# Altium schematic sheet MB_pl_io.SchDoc: Материнская плата
size 420 x 297 mm; DrawnBy: В.Титов; DocumentNumber: ХХХХ.468179.001 Э3; SheetNumber: 4; SheetTotal: 7; DocumentType: Схема электрическая принципиальная; Title2: Питание процессора
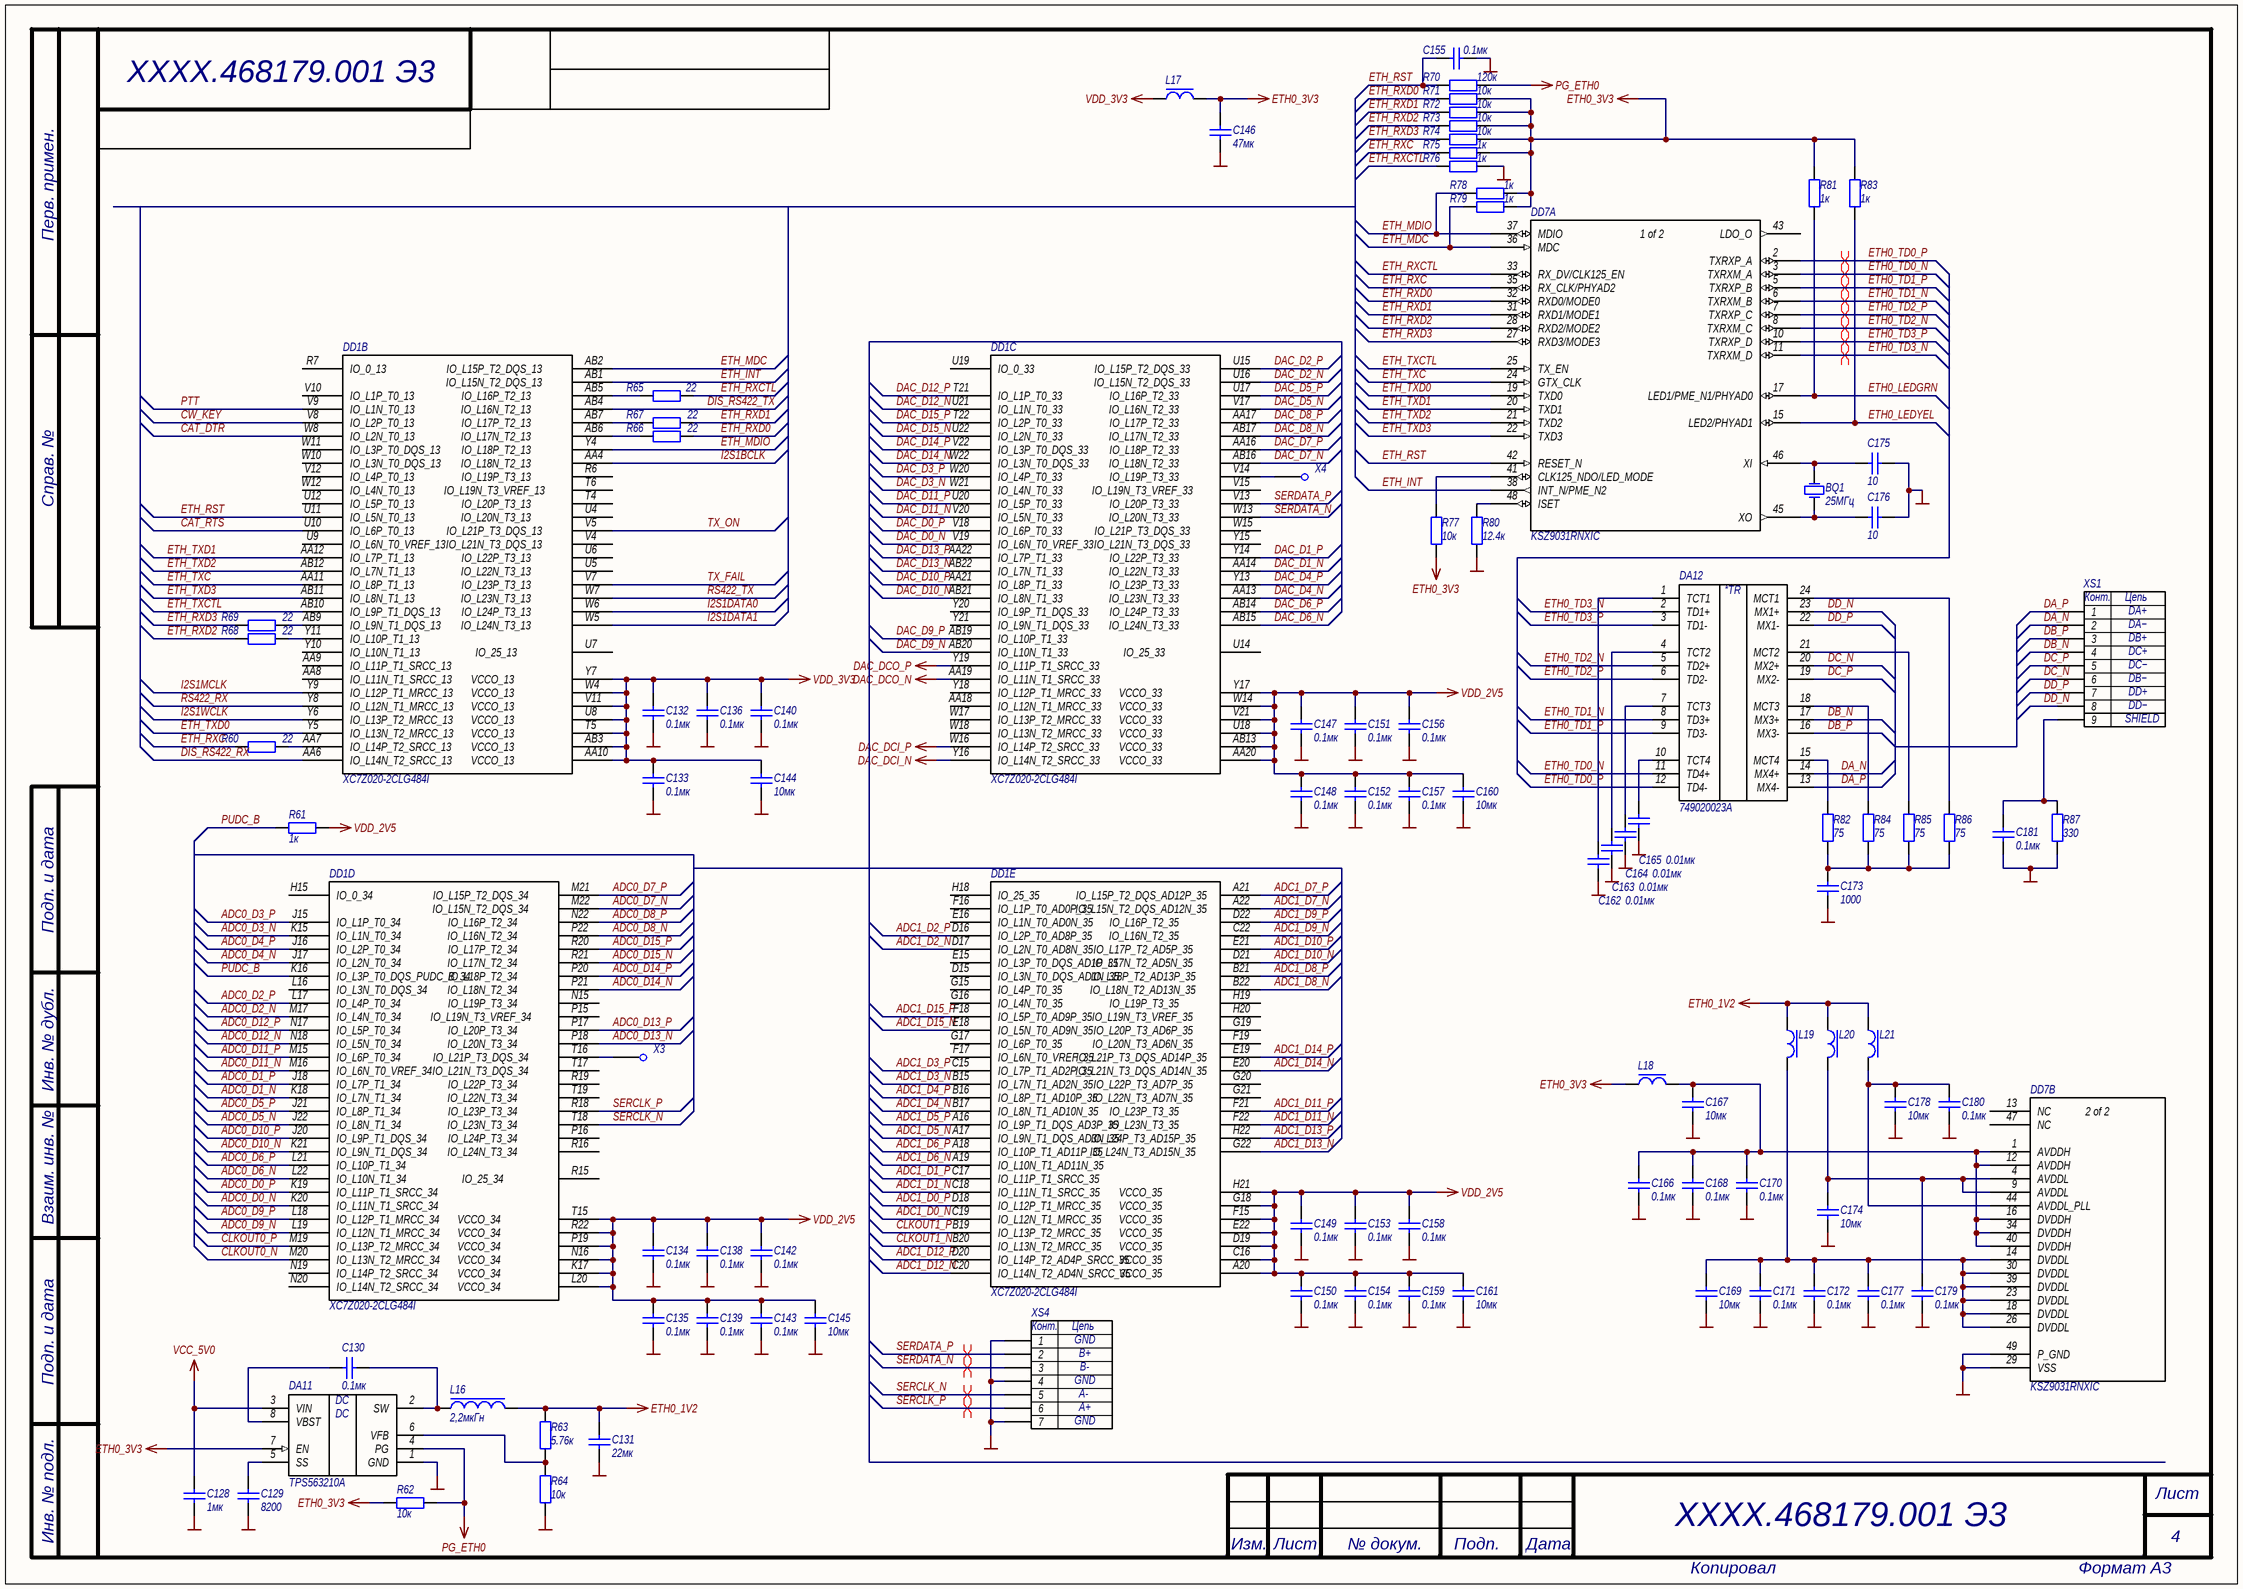
[diagram p0: MB_pl_io.SchDoc]

## Parts
BQ1  25МГц  [ABRACOM ABM10]
C128  1мк  [CAPC1005X06N]
C129  8200  [CAPC1005X06N]
C130  0.1мк  [CAPC1005X06N]
C131  22мк  [CAPC2012X12L]
C132  0.1мк  [CAPC1005X06N]
C133  0.1мк  [CAPC1005X06N]
C134  0.1мк  [CAPC1005X06N]
C135  0.1мк  [CAPC1005X06N]
C136  0.1мк  [CAPC1005X06N]
C138  0.1мк  [CAPC1005X06N]
C139  0.1мк  [CAPC1005X06N]
C140  0.1мк  [CAPC1005X06N]
C142  0.1мк  [CAPC1005X06N]
C143  0.1мк  [CAPC1005X06N]
C144  10мк  [CAPC1608X08L]
C145  10мк  [CAPC1608X08L]
C146  47мк  [CAPC2012X12L]
C147  0.1мк  [CAPC1005X06N]
C148  0.1мк  [CAPC1005X06N]
C149  0.1мк  [CAPC1005X06N]
C150  0.1мк  [CAPC1005X06N]
C151  0.1мк  [CAPC1005X06N]
C152  0.1мк  [CAPC1005X06N]
C153  0.1мк  [CAPC1005X06N]
C154  0.1мк  [CAPC1005X06N]
C155  0.1мк  [CAPC1005X06N]
C156  0.1мк  [CAPC1005X06N]
C157  0.1мк  [CAPC1005X06N]
C158  0.1мк  [CAPC1005X06N]
C159  0.1мк  [CAPC1005X06N]
C160  10мк  [CAPC1608X08L]
C161  10мк  [CAPC1608X08L]
C162  0.01мк  [CAPC1005X06N]
C163  0.01мк  [CAPC1005X06N]
C164  0.01мк  [CAPC1005X06N]
C165  0.01мк  [CAPC1005X06N]
C166  0.1мк  [CAPC1005X06N]
C167  10мк  [CAPC1608X08L]
C168  0.1мк  [CAPC1005X06N]
C169  10мк  [CAPC1608X08L]
C170  0.1мк  [CAPC1005X06N]
C171  0.1мк  [CAPC1005X06N]
C172  0.1мк  [CAPC1005X06N]
C173  1000  [CAPC1005X06N]
C174  10мк  [CAPC1608X08L]
C175  10  [CAPC1005X06N]
C176  10  [CAPC1005X06N]
C177  0.1мк  [CAPC1005X06N]
C178  10мк  [CAPC1608X08L]
C179  0.1мк  [CAPC1005X06N]
C180  0.1мк  [CAPC1005X06N]
C181  0.1мк  [CAPC1608X08L]
DA11  TPS563210A  [TSOP65P280X110-8N]
DA12  749020023A  [749020023A]
DD1  XC7Z020-2CLG484I  [BGA484C80P22X22_1900X1900X160]  (parts B,C,D,E of 9)
DD7  KSZ9031RNXIC  [QFN50P700X700-48V6M]  (parts A,B of 2)
L16  2,2мкГн  [CSAB0420]
L17  BLM18PG121SN1D  [INDC1608X08L]  (value not drawn)
L18  BLM18PG121SN1D  [INDC1608X08L]  (value not drawn)
L19  BLM18PG121SN1D  [INDC1608X08L]  (value not drawn)
L20  BLM18PG121SN1D  [INDC1608X08L]  (value not drawn)
L21  BLM18PG121SN1D  [INDC1608X08L]  (value not drawn)
R60  22  [RESC1005X06N]
R61  1к  [RESC1005X06N]
R62  10к  [RESC1005X06N]
R63  5.76к  [RESC1005X06N]
R64  10к  [RESC1005X06N]
R65  22  [RESC1005X06N]
R66  22  [RESC1005X06N]
R67  22  [RESC1005X06N]
R68  22  [RESC1005X06N]
R69  22  [RESC1005X06N]
R70  120к  [RESC1005X06N]
R71  10к  [RESC1005X06N]
R72  10к  [RESC1005X06N]
R73  10к  [RESC1005X06N]
R74  10к  [RESC1005X06N]
R75  1к  [RESC1005X06N]
R76  1к  [RESC1005X06N]
R77  10к  [RESC1005X06N]
R78  1к  [RESC1005X06N]
R79  1к  [RESC1005X06N]
R80  12.4к  [RESC1005X06N]
R81  1к  [RESC1005X06N]
R82  75  [RESC1005X06N]
R83  1к  [RESC1005X06N]
R84  75  [RESC1005X06N]
R85  75  [RESC1005X06N]
R86  75  [RESC1005X06N]
R87  330  [RESC1005X06N]
X3  Конструктивный элемент  [PIN2_PROBE]  (value not drawn)  (no BOM)
X4  Конструктивный элемент  [PIN2_PROBE]  (value not drawn)  (no BOM)
XS1  TJ16S-8P8C  [KLS12-107L]  (value not drawn)
XS4  KLS1-SATA001  [KLS1-SATA001]  (value not drawn)

## Nets
DAC_DCI_N: DD1.Y16(IO_L14N_T2_SRCC_33)
DAC_DCI_P: DD1.W16(IO_L14P_T2_SRCC_33)
DAC_DCO_N: DD1.AA19(IO_L11N_T1_SRCC_33)
DAC_DCO_P: DD1.Y19(IO_L11P_T1_SRCC_33)
ETH0_1V2: C131.2 L16.2 L19.1 L20.1 L21.1 R63.2
ETH0_3V3: C146.2 DA11.7(EN) L17.2 L18.1 R62.2 R71.2 R72.2 R73.2 R74.2 R75.2 R77.2 R78.2 R79.2 R81.1 R83.1
GND: C128.1 C129.1 C131.1 C132.1 C133.1 C134.1 C135.1 C136.1 C138.1 C139.1 C140.1 C142.1 C143.1 C144.1 C145.1 C146.1 C147.1 C148.1 C149.1 C150.1 C151.1 C152.1 C153.1 C154.1 C155.1 C156.1 C157.1 C158.1 C159.1 C160.1 C161.1 C162.1 C163.1 C164.1 C165.1 C166.1 C167.1 C168.1 C169.1 C170.1 C171.1 C172.1 C173.2 C174.1 C175.1 C176.1 C177.1 C178.1 C179.1 C180.1 C181.2 DA11.1(GND) DD7.29(VSS) DD7.49(P_GND) R64.2 R76.2 R80.2 R87.2 XS4.1 XS4.4 XS4.7
PG_ETH0: DA11.4(PG) R62.1 R70.2
VCC_5V0: C128.2 DA11.3(VIN)
VDD_2V5: C134.2 C135.2 C138.2 C139.2 C142.2 C143.2 C145.2 C147.2 C148.2 C149.2 C150.2 C151.2 C152.2 C153.2 C154.2 C156.2 C157.2 C158.2 C159.2 C160.2 C161.2 DD1.A20(VCCO_35) DD1.AA20(VCCO_33) DD1.AB13(VCCO_33) DD1.C16(VCCO_35) DD1.D19(VCCO_35) DD1.E22(VCCO_35) DD1.F15(VCCO_35) DD1.G18(VCCO_35) DD1.H21(VCCO_35) DD1.K17(VCCO_34) DD1.L20(VCCO_34) DD1.N16(VCCO_34) DD1.P19(VCCO_34) DD1.R22(VCCO_34) DD1.T15(VCCO_34) DD1.U18(VCCO_33) DD1.V21(VCCO_33) DD1.W14(VCCO_33) DD1.Y17(VCCO_33) R61.2
VDD_3V3: C132.2 C133.2 C136.2 C140.2 C144.2 DD1.AA10(VCCO_13) DD1.AB3(VCCO_13) DD1.T5(VCCO_13) DD1.U8(VCCO_13) DD1.V11(VCCO_13) DD1.W4(VCCO_13) DD1.Y7(VCCO_13) L17.1
ADC0_D0_N: DD1.K20(IO_L11N_T1_SRCC_34)
ADC0_D0_P: DD1.K19(IO_L11P_T1_SRCC_34)
ADC0_D1_N: DD1.K18(IO_L7N_T1_34)
ADC0_D1_P: DD1.J18(IO_L7P_T1_34)
ADC0_D2_N: DD1.M17(IO_L4N_T0_34)
ADC0_D2_P: DD1.L17(IO_L4P_T0_34)
ADC0_D3_N: DD1.K15(IO_L1N_T0_34)
ADC0_D3_P: DD1.J15(IO_L1P_T0_34)
ADC0_D4_N: DD1.J17(IO_L2N_T0_34)
ADC0_D4_P: DD1.J16(IO_L2P_T0_34)
ADC0_D5_N: DD1.J22(IO_L8N_T1_34)
ADC0_D5_P: DD1.J21(IO_L8P_T1_34)
ADC0_D6_N: DD1.L22(IO_L10N_T1_34)
ADC0_D6_P: DD1.L21(IO_L10P_T1_34)
ADC0_D7_N: DD1.M22(IO_L15N_T2_DQS_34)
ADC0_D7_P: DD1.M21(IO_L15P_T2_DQS_34)
ADC0_D8_N: DD1.P22(IO_L16N_T2_34)
ADC0_D8_P: DD1.N22(IO_L16P_T2_34)
ADC0_D9_N: DD1.L19(IO_L12N_T1_MRCC_34)
ADC0_D9_P: DD1.L18(IO_L12P_T1_MRCC_34)
ADC0_D10_N: DD1.K21(IO_L9N_T1_DQS_34)
ADC0_D10_P: DD1.J20(IO_L9P_T1_DQS_34)
ADC0_D11_N: DD1.M16(IO_L6N_T0_VREF_34)
ADC0_D11_P: DD1.M15(IO_L6P_T0_34)
ADC0_D12_N: DD1.N18(IO_L5N_T0_34)
ADC0_D12_P: DD1.N17(IO_L5P_T0_34)
ADC0_D13_N: DD1.P18(IO_L20N_T3_34)
ADC0_D13_P: DD1.P17(IO_L20P_T3_34)
ADC0_D14_N: DD1.P21(IO_L18N_T2_34)
ADC0_D14_P: DD1.P20(IO_L18P_T2_34)
ADC0_D15_N: DD1.R21(IO_L17N_T2_34)
ADC0_D15_P: DD1.R20(IO_L17P_T2_34)
ADC1_D0_N: DD1.C19(IO_L12N_T1_MRCC_35)
ADC1_D0_P: DD1.D18(IO_L12P_T1_MRCC_35)
ADC1_D1_N: DD1.C18(IO_L11N_T1_SRCC_35)
ADC1_D1_P: DD1.C17(IO_L11P_T1_SRCC_35)
ADC1_D2_N: DD1.D17(IO_L2N_T0_AD8N_35)
ADC1_D2_P: DD1.D16(IO_L2P_T0_AD8P_35)
ADC1_D3_N: DD1.B15(IO_L7N_T1_AD2N_35)
ADC1_D3_P: DD1.C15(IO_L7P_T1_AD2P_35)
ADC1_D4_N: DD1.B17(IO_L8N_T1_AD10N_35)
ADC1_D4_P: DD1.B16(IO_L8P_T1_AD10P_35)
ADC1_D5_N: DD1.A17(IO_L9N_T1_DQS_AD3N_35)
ADC1_D5_P: DD1.A16(IO_L9P_T1_DQS_AD3P_35)
ADC1_D6_N: DD1.A19(IO_L10N_T1_AD11N_35)
ADC1_D6_P: DD1.A18(IO_L10P_T1_AD11P_35)
ADC1_D7_N: DD1.A22(IO_L15N_T2_DQS_AD12N_35)
ADC1_D7_P: DD1.A21(IO_L15P_T2_DQS_AD12P_35)
ADC1_D8_N: DD1.B22(IO_L18N_T2_AD13N_35)
ADC1_D8_P: DD1.B21(IO_L18P_T2_AD13P_35)
ADC1_D9_N: DD1.C22(IO_L16N_T2_35)
ADC1_D9_P: DD1.D22(IO_L16P_T2_35)
ADC1_D10_N: DD1.D21(IO_L17N_T2_AD5N_35)
ADC1_D10_P: DD1.E21(IO_L17P_T2_AD5P_35)
ADC1_D11_N: DD1.F22(IO_L23N_T3_35)
ADC1_D11_P: DD1.F21(IO_L23P_T3_35)
ADC1_D12_N: DD1.C20(IO_L14N_T2_AD4N_SRCC_35)
ADC1_D12_P: DD1.D20(IO_L14P_T2_AD4P_SRCC_35)
ADC1_D13_N: DD1.G22(IO_L24N_T3_AD15N_35)
ADC1_D13_P: DD1.H22(IO_L24P_T3_AD15P_35)
ADC1_D14_N: DD1.E20(IO_L21N_T3_DQS_AD14N_35)
ADC1_D14_P: DD1.E19(IO_L21P_T3_DQS_AD14P_35)
ADC1_D15_N: DD1.E18(IO_L5N_T0_AD9N_35)
ADC1_D15_P: DD1.F18(IO_L5P_T0_AD9P_35)
CAT_DTR: DD1.W8(IO_L2N_T0_13)
CAT_RTS: DD1.U10(IO_L6P_T0_13)
CLKOUT0_N: DD1.M20(IO_L13N_T2_MRCC_34)
CLKOUT0_P: DD1.M19(IO_L13P_T2_MRCC_34)
CLKOUT1_N: DD1.B20(IO_L13N_T2_MRCC_35)
CLKOUT1_P: DD1.B19(IO_L13P_T2_MRCC_35)
CW_KEY: DD1.V8(IO_L2P_T0_13)
DA_N: DA12.14(MX4+) XS1.2
DA_P: DA12.13(MX4-) XS1.1
DAC_D0_N: DD1.V19(IO_L6N_T0_VREF_33)
DAC_D0_P: DD1.V18(IO_L6P_T0_33)
DAC_D1_N: DD1.AA14(IO_L22N_T3_33)
DAC_D1_P: DD1.Y14(IO_L22P_T3_33)
DAC_D2_N: DD1.U16(IO_L15N_T2_DQS_33)
DAC_D2_P: DD1.U15(IO_L15P_T2_DQS_33)
DAC_D3_N: DD1.W21(IO_L4N_T0_33)
DAC_D3_P: DD1.W20(IO_L4P_T0_33)
DAC_D4_N: DD1.AA13(IO_L23N_T3_33)
DAC_D4_P: DD1.Y13(IO_L23P_T3_33)
DAC_D5_N: DD1.V17(IO_L16N_T2_33)
DAC_D5_P: DD1.U17(IO_L16P_T2_33)
DAC_D6_N: DD1.AB15(IO_L24N_T3_33)
DAC_D6_P: DD1.AB14(IO_L24P_T3_33)
DAC_D7_N: DD1.AB16(IO_L18N_T2_33)
DAC_D7_P: DD1.AA16(IO_L18P_T2_33)
DAC_D8_N: DD1.AB17(IO_L17N_T2_33)
DAC_D8_P: DD1.AA17(IO_L17P_T2_33)
DAC_D9_N: DD1.AB20(IO_L10N_T1_33)
DAC_D9_P: DD1.AB19(IO_L10P_T1_33)
DAC_D10_N: DD1.AB21(IO_L8N_T1_33)
DAC_D10_P: DD1.AA21(IO_L8P_T1_33)
DAC_D11_N: DD1.V20(IO_L5N_T0_33)
DAC_D11_P: DD1.U20(IO_L5P_T0_33)
DAC_D12_N: DD1.U21(IO_L1N_T0_33)
DAC_D12_P: DD1.T21(IO_L1P_T0_33)
DAC_D13_N: DD1.AB22(IO_L7N_T1_33)
DAC_D13_P: DD1.AA22(IO_L7P_T1_33)
DAC_D14_N: DD1.W22(IO_L3N_T0_DQS_33)
DAC_D14_P: DD1.V22(IO_L3P_T0_DQS_33)
DAC_D15_N: DD1.U22(IO_L2N_T0_33)
DAC_D15_P: DD1.T22(IO_L2P_T0_33)
DB_N: DA12.17(MX3+) XS1.4
DB_P: DA12.16(MX3-) XS1.3
DC_N: DA12.20(MX2+) XS1.6
DC_P: DA12.19(MX2-) XS1.5
DD_N: DA12.23(MX1+) XS1.8
DD_P: DA12.22(MX1-) XS1.7
DIS_RS422_RX: DD1.AA6(IO_L14N_T2_SRCC_13)
DIS_RS422_TX: DD1.AB4(IO_L16N_T2_13)
ETH0_LEDGRN: DD7.17(LED1/PME_N1/PHYAD0) R81.2
ETH0_LEDYEL: DD7.15(LED2/PHYAD1) R83.2
ETH0_TD0_N: DA12.11(TD4+) DD7.3(TXRXM_A)
ETH0_TD0_P: DA12.12(TD4-) DD7.2(TXRXP_A)
ETH0_TD1_N: DA12.8(TD3+) DD7.6(TXRXM_B)
ETH0_TD1_P: DA12.9(TD3-) DD7.5(TXRXP_B)
ETH0_TD2_N: DA12.5(TD2+) DD7.8(TXRXM_C)
ETH0_TD2_P: DA12.6(TD2-) DD7.7(TXRXP_C)
ETH0_TD3_N: DA12.2(TD1+) DD7.11(TXRXM_D)
ETH0_TD3_P: DA12.3(TD1-) DD7.10(TXRXP_D)
ETH_INT: DD1.AB1(IO_L15N_T2_DQS_13) DD7.38(INT_N/PME_N2)
ETH_MDC: DD1.AB2(IO_L15P_T2_DQS_13) DD7.36(MDC) R79.1
ETH_MDIO: DD1.Y4(IO_L18P_T2_13) DD7.37(MDIO) R78.1
ETH_RST: C155.2 DD1.U11(IO_L5N_T0_13) DD7.42(RESET_N) R70.1
ETH_RXC: DD7.35(RX_CLK/PHYAD2) R60.1 R75.1
ETH_RXCTL: DD7.33(RX_DV/CLK125_EN) R65.1 R76.1
ETH_RXD0: DD7.32(RXD0/MODE0) R66.2 R71.1
ETH_RXD1: DD7.31(RXD1/MODE1) R67.2 R72.1
ETH_RXD2: DD7.28(RXD2/MODE2) R68.1 R73.1
ETH_RXD3: DD7.27(RXD3/MODE3) R69.1 R74.1
ETH_TXC: DD1.AA11(IO_L8P_T1_13) DD7.24(GTX_CLK)
ETH_TXCTL: DD1.AB10(IO_L9P_T1_DQS_13) DD7.25(TX_EN)
ETH_TXD0: DD1.Y5(IO_L13N_T2_MRCC_13) DD7.19(TXD0)
ETH_TXD1: DD1.AA12(IO_L7P_T1_13) DD7.20(TXD1)
ETH_TXD2: DD1.AB12(IO_L7N_T1_13) DD7.21(TXD2)
ETH_TXD3: DD1.AB11(IO_L8N_T1_13) DD7.22(TXD3)
I2S1BCLK: DD1.AA4(IO_L18N_T2_13)
I2S1DATA0: DD1.W6(IO_L24P_T3_13)
I2S1DATA1: DD1.W5(IO_L24N_T3_13)
I2S1MCLK: DD1.Y9(IO_L12P_T1_MRCC_13)
I2S1WCLK: DD1.Y6(IO_L13P_T2_MRCC_13)
PTT: DD1.V9(IO_L1N_T0_13)
PUDC_B: DD1.K16(IO_L3P_T0_DQS_PUDC_B_34) R61.1
RS422_RX: DD1.Y8(IO_L12N_T1_MRCC_13)
RS422_TX: DD1.W7(IO_L23N_T3_13)
SERCLK_N: DD1.T18(IO_L23N_T3_34) XS4.5
SERCLK_P: DD1.R18(IO_L23P_T3_34) XS4.6
SERDATA_N: DD1.W13(IO_L20N_T3_33) XS4.3
SERDATA_P: DD1.V13(IO_L20P_T3_33) XS4.2
TX_FAIL: DD1.V7(IO_L23P_T3_13)
TX_ON: DD1.V5(IO_L21P_T3_DQS_13)
NetBQ1_1: BQ1.1(OSC1) C175.2 DD7.46(XI)
NetBQ1_3: BQ1.3(OSC2) C176.2 DD7.45(XO)
NetC129_2: C129.2 DA11.5(SS)
NetC130_1: C130.1 DA11.2(SW) L16.1
NetC130_2: C130.2 DA11.8(VBST)
NetC162_2: C162.2 DA12.1(TCT1)
NetC163_2: C163.2 DA12.4(TCT2)
NetC164_2: C164.2 DA12.7(TCT3)
NetC165_2: C165.2 DA12.10(TCT4)
NetC166_2: C166.2 C167.2 C168.2 C170.2 DD7.1(AVDDH) DD7.12(AVDDH) DD7.16(DVDDH) DD7.34(DVDDH) DD7.40(DVDDH) L18.2
NetC169_2: C169.2 C171.2 C172.2 C177.2 DD7.14(DVDDL) DD7.18(DVDDL) DD7.23(DVDDL) DD7.26(DVDDL) DD7.30(DVDDL) DD7.39(DVDDL) L19.2
NetC173_1: C173.1 R82.2 R84.2 R85.2 R86.2
NetC174_2: C174.2 C179.2 DD7.4(AVDDL) DD7.9(AVDDL) L20.2
NetC178_2: C178.2 C180.2 DD7.44(AVDDL_PLL) L21.2
NetC181_1: C181.1 R87.1 XS1.9
NetDA11_6: DA11.6(VFB) R63.1 R64.1
NetDA12_15: DA12.15(MCT4) R82.1
NetDA12_18: DA12.18(MCT3) R84.1
NetDA12_21: DA12.21(MCT2) R85.1
NetDA12_24: DA12.24(MCT1) R86.1
NetDD1_AA7   : DD1.AA7(IO_L14P_T2_SRCC_13) R60.2
NetDD1_AB5   : DD1.AB5(IO_L16P_T2_13) R65.2
NetDD1_AB6   : DD1.AB6(IO_L17N_T2_13) R66.1
NetDD1_AB7   : DD1.AB7(IO_L17P_T2_13) R67.1
NetDD1_AB9   : DD1.AB9(IO_L9N_T1_DQS_13) R69.2
NetDD1_T16   : DD1.T16(IO_L21P_T3_DQS_34) X3.1
NetDD1_V14   : DD1.V14(IO_L19P_T3_33) X4.1
NetDD1_Y11   : DD1.Y11(IO_L10P_T1_13) R68.2
NetDD7_41: DD7.41(CLK125_NDO/LED_MODE) R77.1
NetDD7_48: DD7.48(ISET) R80.1

Not connected (* = marked no-connect by the designer): DD1 AA8   (IO_L11N_T1_SRCC_13_______) AA9   (IO_L11P_T1_SRCC_13_______) AA18  (IO_L12N_T1_MRCC_33_______) D15   (IO_L3N_T0_DQS_AD1N_35____) E15   (IO_L3P_T0_DQS_AD1P_35____) E16   (IO_L1N_T0_AD0N_35________) F16   (IO_L1P_T0_AD0P_35________) F17   (IO_L6N_T0_VREF_35________) F19   (IO_L20N_T3_AD6N_35_______) G15   (IO_L4P_T0_35_____________) G16   (IO_L4N_T0_35_____________) G17   (IO_L6P_T0_35_____________) G19   (IO_L20P_T3_AD6P_35_______) G20   (IO_L22P_T3_AD7P_35_______) G21   (IO_L22N_T3_AD7N_35_______) H15   (IO_0_34__________________) H18   (IO_25_35_________________) H19   (IO_L19P_T3_35____________) H20   (IO_L19N_T3_VREF_35_______) L16   (IO_L3N_T0_DQS_34_________) N15   (IO_L19P_T3_34____________) N19   (IO_L14P_T2_SRCC_34_______) N20   (IO_L14N_T2_SRCC_34_______) P15   (IO_L19N_T3_VREF_34_______) P16   (IO_L24P_T3_34____________) R6    (IO_L19P_T3_13____________) R7    (IO_0_13__________________) R15   (IO_25_34_________________) R16   (IO_L24N_T3_34____________) R19   (IO_L22P_T3_34____________) T4    (IO_L20P_T3_13____________) T6    (IO_L19N_T3_VREF_13_______) T17   (IO_L21N_T3_DQS_34________) T19   (IO_L22N_T3_34____________) U4    (IO_L20N_T3_13____________) U5    (IO_L22N_T3_13____________) U6    (IO_L22P_T3_13____________) U7    (IO_25_13_________________) U9    (IO_L6N_T0_VREF_13________) U12   (IO_L5P_T0_13_____________) U14   (IO_25_33_________________) U19   (IO_0_33__________________) V4    (IO_L21N_T3_DQS_13________) V10   (IO_L1P_T0_13_____________) V12   (IO_L4P_T0_13_____________) V15   (IO_L19N_T3_VREF_33_______) W10   (IO_L3N_T0_DQS_13_________) W11   (IO_L3P_T0_DQS_13_________) W12   (IO_L4N_T0_13_____________) W15   (IO_L21P_T3_DQS_33________) W17   (IO_L13P_T2_MRCC_33_______) W18   (IO_L13N_T2_MRCC_33_______) Y10   (IO_L10N_T1_13____________) Y15   (IO_L21N_T3_DQS_33________) Y18   (IO_L12P_T1_MRCC_33_______) Y20   (IO_L9P_T1_DQS_33_________) Y21   (IO_L9N_T1_DQS_33_________); DD7 13(NC) 43(LDO_O) 47(NC)

## Layout directives
differential pair: ETH0_TD0_N, ETH0_TD0_P, ETH0_TD1_N, ETH0_TD1_P, ETH0_TD2_N, ETH0_TD2_P, ETH0_TD3_N, ETH0_TD3_P, SERCLK_N, SERCLK_P, SERDATA_N, SERDATA_P

## Notes on the sheet
- Перв. примен.
- Справ. №
- Подп. и дата
- Инв. № дубл.
- Взаим. инв. №
- Инв. № подл.
- Лист
- Изм.
- № докум.
- Подп.
- Дата
- Копировал
- Формат А3
- (in symbol Микросхема KSZ9031RNXIC, part A) 1 of 2
- (in symbol Микросхема KSZ9031RNXIC, part B) 2 of 2
- (in symbol Микросхема TPS563210A) DC
- (in symbol Сборка трансформаторов 749020023A) *TR
- (in symbol Соединитель KLS1-SATA001) Конт.; Цепь; GND; B+; B-; A-; A+
- (in symbol Соединитель KLS12-107L-2-8P8C-0) Конт.; Цепь; DA+; DA−; DB+; DC+; DC−; DB−; DD+; DD−; SHIELD

## Library data of the parts
BQ1 = Кварц ABM10-25.000MHZ-D30: Резонатор кварцевый; Manufacturer: ABRACON; Tolerance: ±20 ppm; Value: 25МГц
C128 = Кер.ЧИП конд. 0402 1мкФ X5R 10%, 10В: Кер. ЧИП-конденсатор; Power/Voltage: 10В; TKE: X5R; Tolerance: ±10%; PackageReference: 0402; Value: 1мк
C129 = Кер.ЧИП конд. 0402 8200пФ X7R 10%, 50В: Кер. ЧИП-конденсатор; Power/Voltage: 50В; TKE: X7R; Tolerance: ±20%; Value: 8200
C130 C132-C136 C138-C140 C142 C143 C147-C159 C166 C168 C170-C172 C177 C179 C180 = Кер.ЧИП конд. 0402 0.1мкФ X7R 10%, 16В: Кер. ЧИП-конденсатор; Power/Voltage: 16В; TKE: X7R; Tolerance: ±10%; PackageReference: 0402; Value: 0.1мк
C131 = Кер.ЧИП конд. 0805 22мкФ X5R 10% 16В: Кер. ЧИП-конденсатор; Manufacturer: TDK; ManufacturerPartNumber: C2012X5R1C226KT; Power/Voltage: 16В; TKE: X5R; Tolerance: ±10%; Value: 22мк
C144 C145 C160 C161 C167 C169 C174 C178 = Кер.ЧИП конд. 0603 10мкФ X5R 20% 6.3В: Кер. ЧИП-конденсатор; Manufacturer: Murata; ManufacturerPartNumber: GRM188R61A106KE69D; Power/Voltage: 6.3В; TKE: X5R; Tolerance: ±20%; Value: 10мк
C146 = Кер.ЧИП конд. 0805 47мкФ X5R 20% 10В: Кер. ЧИП-конденсатор; Manufacturer: Murata; ManufacturerPartNumber: GRM21BR61A476ME15L; Power/Voltage: 10В; TKE: X5R; Tolerance: ±20%; Value: 47мк
C162-C165 = Кер.ЧИП конд. 0402 0.01мкФ X7R 10%, 50В: Кер. ЧИП-конденсатор; Power/Voltage: 50В; TKE: X7R; Tolerance: ±20%; Value: 0.01мк
C173 = Кер.ЧИП конд. 0402 1000пФ NP0 5%, 50В: Кер. ЧИП-конденсатор; Power/Voltage: 50В; TKE: NPO; Tolerance: ±5%; Value: 1000; PackageReference: 0402
C175 C176 = Кер.ЧИП конд. 0402 10пФ NPO 5%, 50В: Кер. ЧИП-конденсатор; Power/Voltage: 50В; TKE: NPO; Tolerance: ±5%; PackageReference: 0402; Value: 10
C181 = Кер.ЧИП конд. 0603 0.1мкФ X7R 10% 50В: Кер. ЧИП-конденсатор; Manufacturer: Murata; ManufacturerPartNumber: GRM188R71H104KA93D; Power/Voltage: 50В; TKE: X7R; Tolerance: ±10%; Value: 0.1мк
DA11 = Микросхема TPS563210A: TPS56x210A, 4.5-V to 17-V Input, 2-A, 3-A Synchrono; Manufacturer: TI; Value: TPS563210A
DA12 = Сборка трансформаторов 749020023A: 1000BASE-T Magnetics Module; Manufacturer: Wurth Elektronik; Value: 749020023A
DD1 = Микросхема XC7Z020-2CLG484I: Zynq®-7000 SoC Family; Manufacturer: XILINX; Value: XC7Z020-2CLG484I; ComponentLink1Description: datasheet; ComponentLink1URL: https://www.xilinx.com/support/documentation/data_sheets/ds925-zynq-ultrascale-plus.pdf
DD7 = Микросхема KSZ9031RNXIC: Gigabit Ethernet Transceiver with Power Saving Features; SourceLibrary: Add_to_database_2020-10-19; Built_By: EMA_Cory; Vendor: Microchip; Datasheet: https://ww1.microchip.com/downloads/en/DeviceDoc/00002117F.pdf; Copyright: Copyright (C) 2018 Accelerated Designs. All rights reserved; Manufacturer_Part_Number: KSZ9031RNXIC; RefDes: RefDes; Type: DEV; Value: KSZ9031RNXIC
L16 = ЧИП индуктивность CSAB0420-2R2M: Molding Power Choke; Manufacturer: Vishay; ManufacturerPartNumber: IHLP1616ABER1R0M11; Value: 2,2мкГн
L17-L21 = ЧИП дроссель 0603 BLM18PG121SN1D: SMD EMI Suppression Filter EMIFIL; Manufacturer: Murata; ManufacturerPartNumber: BLM18PG121SN1D; Value: BLM18PG121SN1D
R60 R65-R69 = Чип резистор 0402 22 Ом, 5%: ЧИП-резистор; Tolerance: ±5%; TKE: 100 ppm/°С; PackageReference: 0402; Value: 22
R61 R75 R76 R78 R79 R81 R83 = Чип резистор 0402 1 кОм, 5%: ЧИП-резистор; Tolerance: ±5%; TKE: 100 ppm/°С; PackageReference: 0402; Value: 1к
R62 = Чип резистор 0402 10 кОм, 1%: ЧИП-резистор; Tolerance: ±5%; TKE: 100 ppm/°С; PackageReference: 0402; Value: 10к
R63 = Чип резистор 0402 5,76 кОм, 1%: ЧИП-резистор; Tolerance: ±1%; TKE: 100 ppm/°С; PackageReference: 0402; Value: 5.76к
R64 R71-R74 R77 = Чип резистор 0402 10 кОм, 5%: ЧИП-резистор; Tolerance: ±5%; TKE: 100 ppm/°С; PackageReference: 0402; Value: 10к
R70 = Чип резистор 0402 120 кОм, 5%: ЧИП-резистор; Tolerance: ±5%; TKE: 100 ppm/°С; PackageReference: 0402; Value: 120к
R80 = Чип резистор 0402 12.4 кОм, 1%: ЧИП-резистор; Tolerance: ±1%; TKE: 100 ppm/°С; PackageReference: 0402; Value: 12.4к
R82 R84-R86 = Чип резистор 0402 75 Ом, 5%: ЧИП-резистор; Tolerance: ±5%; TKE: 100 ppm/°С; PackageReference: 0402; Value: 75
R87 = Чип резистор 0402 330 Ом, 5%: ЧИП-резистор; Tolerance: ±5%; TKE: 100 ppm/°С; PackageReference: 0402; Value: 330
X3 X4 = Соединение под пайку: Соединитель; Value: Конструктивный элемент
XS1 = Соединитель KLS12-107L-2-8P8C-0: Modular Jack RJ45; Manufacturer: KLS; Value: TJ16S-8P8C
XS4 = Соединитель KLS1-SATA001: SATA Type A 7P Male Connector,SMD; Manufacturer: KLS; Value: KLS1-SATA001